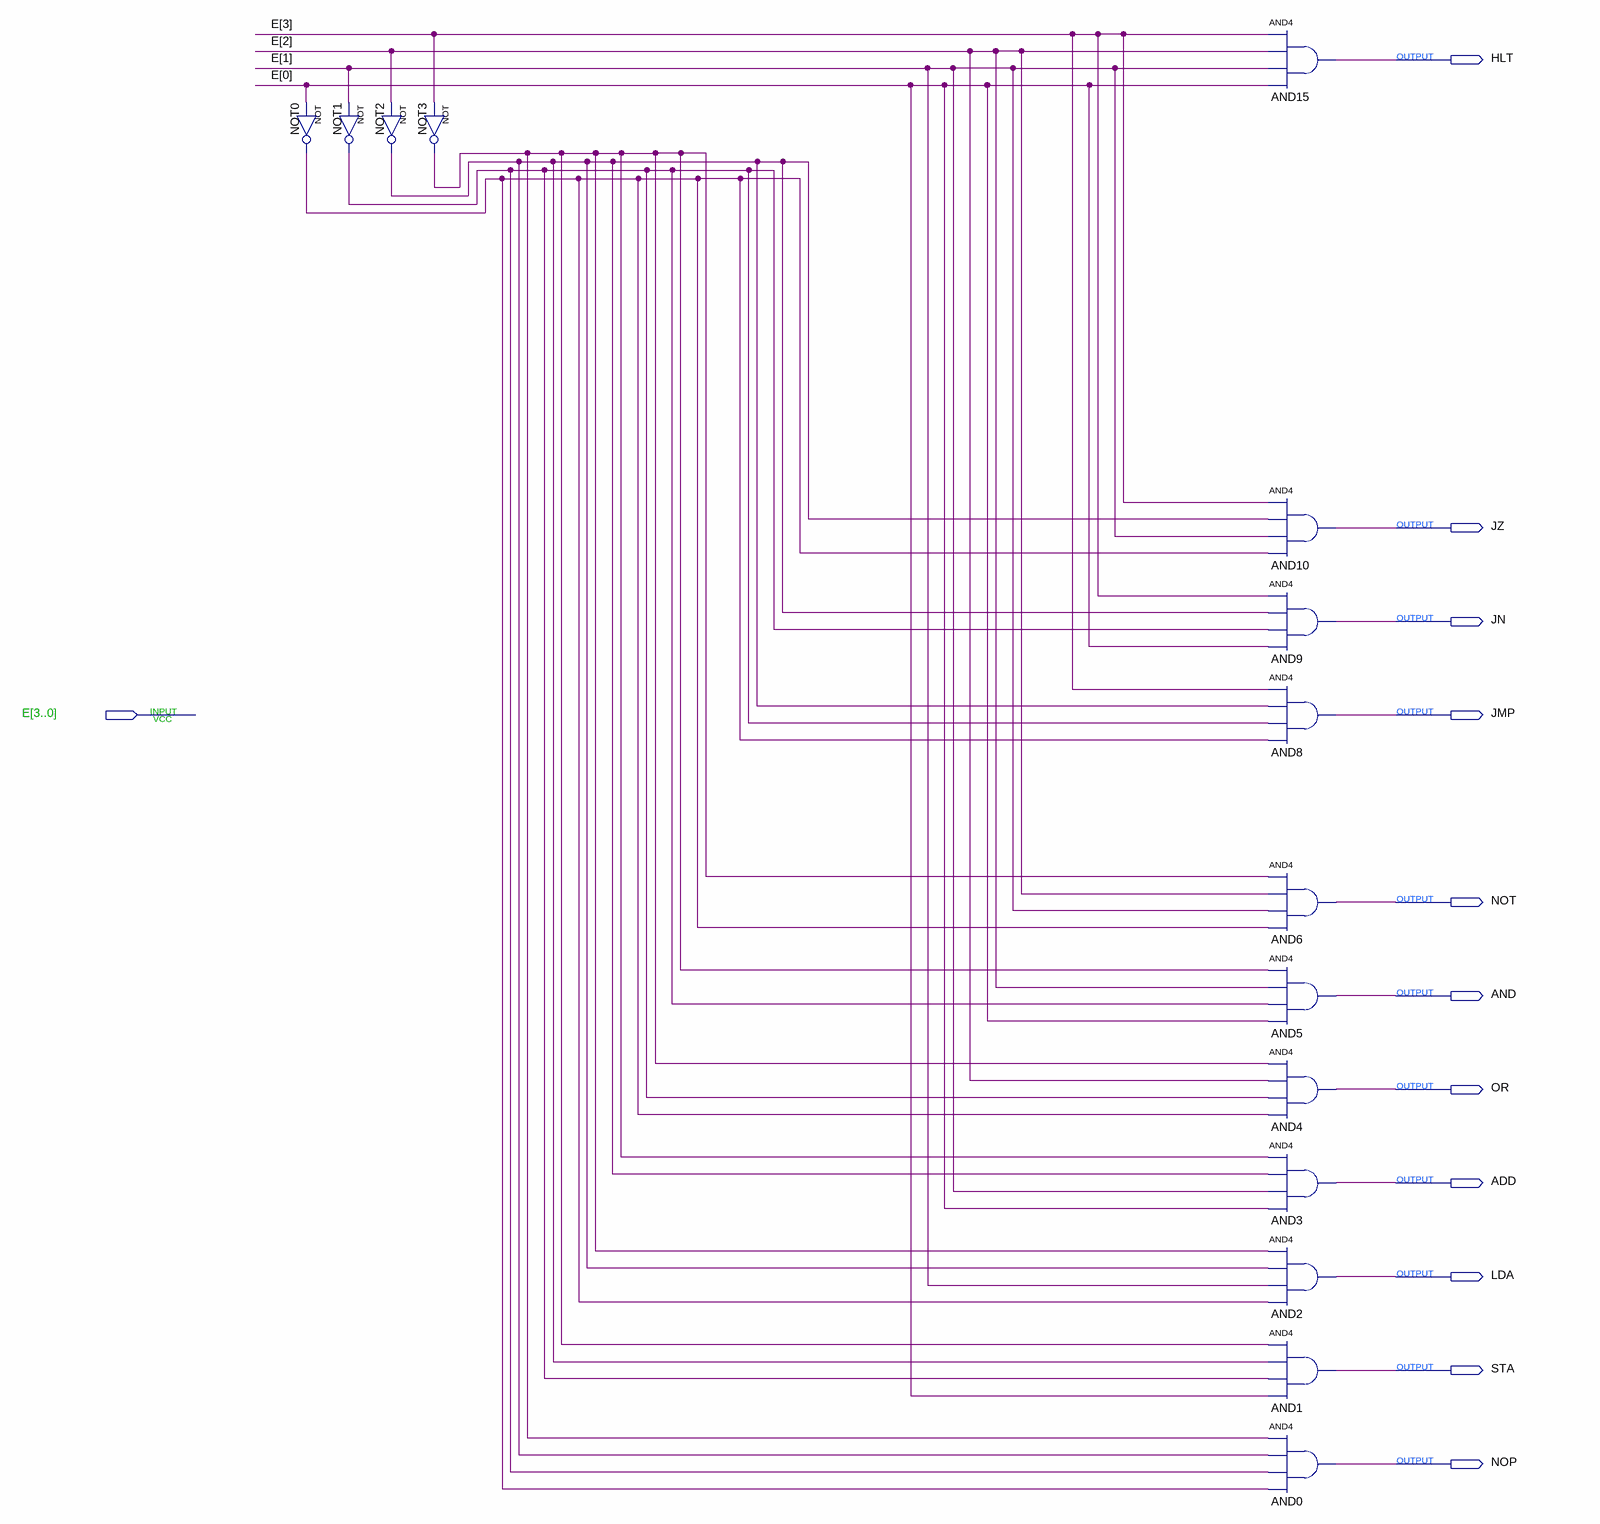
[diagram p0: schematic sheet]
// Quartus schematic DECOD_INST.bdf as structural Verilog: 15 symbols, 12 pins
module DECOD_INST (
  input  [3:0] E,
  output HLT,
  output JZ,
  output JN,
  output JMP,
  output NOT,
  output AND,
  output OR,
  output ADD,
  output LDA,
  output STA,
  output NOP
);

  wire NOT0_out, NOT1_out, NOT2_out, NOT3_out;

  not NOT0 (NOT0_out, E[0]);
  not NOT1 (NOT1_out, E[1]);
  not NOT2 (NOT2_out, E[2]);
  not NOT3 (NOT3_out, E[3]);
  and AND15 (HLT, E[3], E[2], E[1], E[0]);
  and AND10 (JZ, E[3], NOT2_out, E[1], NOT0_out);
  and AND9 (JN, E[3], NOT2_out, NOT1_out, E[0]);
  and AND8 (JMP, E[3], NOT2_out, NOT1_out, NOT0_out);
  and AND6 (NOT, NOT3_out, E[2], E[1], NOT0_out);
  and AND5 (AND, NOT3_out, E[2], NOT1_out, E[0]);
  and AND4 (OR, NOT3_out, E[2], NOT1_out, NOT0_out);
  and AND3 (ADD, NOT3_out, NOT2_out, E[1], E[0]);
  and AND2 (LDA, NOT3_out, NOT2_out, E[1], NOT0_out);
  and AND1 (STA, NOT3_out, NOT2_out, NOT1_out, E[0]);
  and AND0 (NOP, NOT3_out, NOT2_out, NOT1_out, NOT0_out);
endmodule
